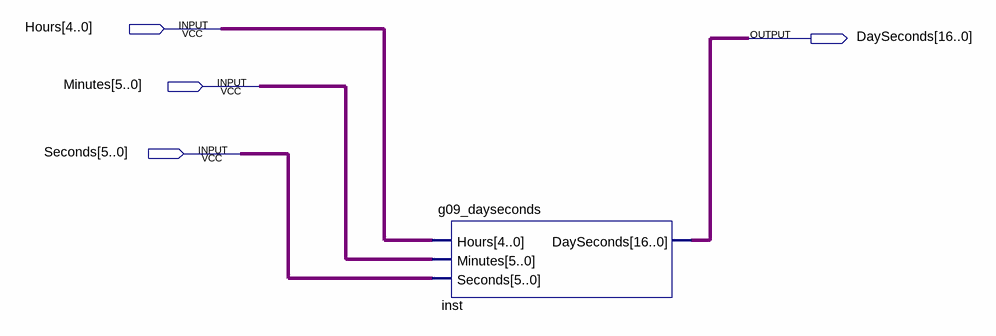
[diagram p0: schematic sheet]
// Quartus schematic g09_dayseconds_sch.bdf as structural Verilog: 1 symbols, 4 pins
module g09_dayseconds_sch (
  input  [4:0] Hours,
  input  [5:0] Minutes,
  input  [5:0] Seconds,
  output [16:0] DaySeconds
);

  g09_dayseconds inst (.Hours(Hours), .Minutes(Minutes), .Seconds(Seconds), .DaySeconds(DaySeconds));
endmodule
